# Altium schematic sheet Power Regulator.SchDoc
size A4; SheetNumber: 2; SheetTotal: 8
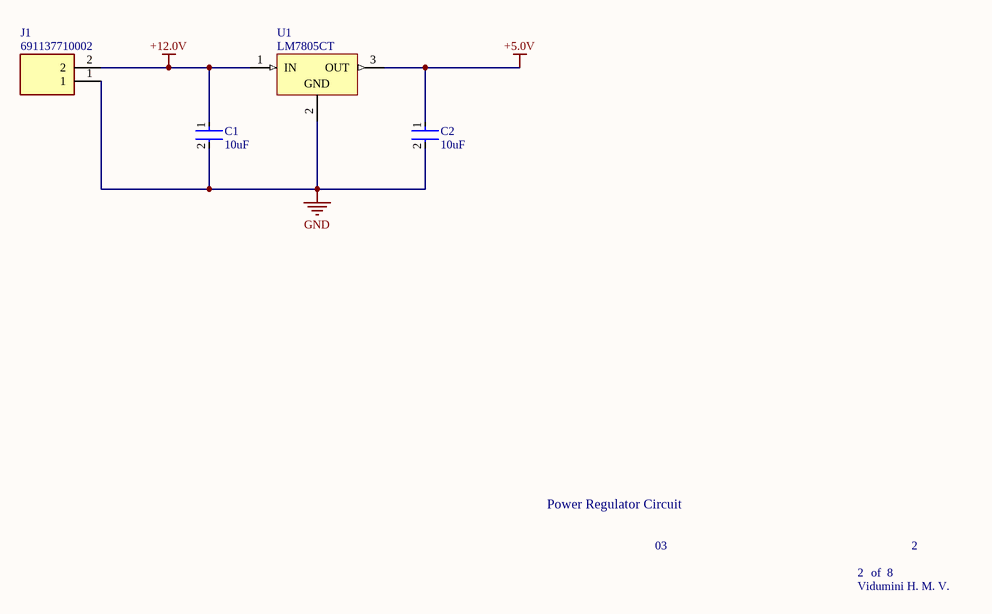
[diagram p0: Power Regulator.SchDoc]

## Parts
C1  10uF  [FP-1206-L_3_2_0_2-W_1_6_0-IPC_B]
C2  10uF  [FP-1206-L_3_2_0_2-W_1_6_0-IPC_B]
J1  691137710002  [SHDR2W70P0X500_1X2_1000X750X1160P]
U1  LM7805CT  [FAIR-TO-220-3]

## Nets
+5.0V: C2.1 U1.3(OUT)
+12.0V: C1.1 J1.2 U1.1(IN)
GND: C1.2 C2.2 J1.1 U1.2(GND)

## Notes on the sheet
- Power Regulator Circuit
- 03
- 2
- of  8
- Vidumini H. M. V.

## Library data of the parts
C1 C2 = CMP-2000-05863-2: General Purpose Ceramic Capacitor, 1206, 10uF, 10%, X5R, 15%, 25V; Height: 0.07mm; Packaging: Tape and Reel; Depth: 1.6mm; Voltage Rating (DC): 25V; Dielectric Material: Ceramic; Contact Plating: Tin; Width: 0.063inch; Capacitance: 10uF; Length: 3.2mm; Thickness: 0.07inch; Voltage Rating: 25V; RoHS Compliant: Yes; Min Operating Temperature: -55°C; Construction: Flat; Case Code (Imperial): 1206; Case Code (Metric): 3216; Mount: Surface Mount; Radiation Hardening: No; Termination: SMD/SMT; Package Quantity: 1; REACH SVHC: No SVHC; Number of Pins: 2; Tolerance: 10%; Series: -; Case/Package: 1206; Voltage: 25V; Dielectric: X5R; Max Operating Temperature: 85°C; Lead Free: Lead Free
J1 = 691137710002: Connector; Manufacturer_Name: Wurth Elektronik; Datasheet Link: https://katalog.we-online.com/em/datasheet/691137710002.pdf; Height: 11.6mm; Manufacturer_Part_Number: 691137710002; Mouser Part Number: 710-691137710002; Mouser Price/Stock: https://www.mouser.co.uk/ProductDetail/Wurth-Elektronik/691137710002?qs=lBTPRtX1sU9LnHBbviNKGA%3D%3D
U1 = CMP-2000-04938-1: Positive Voltage Regulator, 5 V, 1 A, -40 to 125 degC, 3-Pin TO-220, RoHS, Tube; Manufacturer: FairchildSemiconductor; Maximum Input Voltage: 35V; Maximum Quiescent Current: 8mA; Load Regulation: 100mV; Maximum Output Current: 2.2(Typ)A; Output Type: Fixed; Typical Dropout Voltage @ Current: 2@1AV; Rad Hard: No; Output Voltage: 5V; Accuracy: ±4%; Number of Outputs: 1; Category: LinearRegulator; Package Description: 3-Pin Through Hole Device, Body 10 x 4.5 mm, Pitch 2.54 mm; Packaging: Rail/Tube; Mounting: ThroughHole; Polarity: Positive; Manufacturer URL: https://www.fairchildsemi.com/; Line Regulation: 100mV; Datasheet Version: Aug-12; Datasheet URL: https://datasheet.ciiva.com/26904/lm7805ct-26904988.pdf; Package Reference: TO-220; Package URL: https://www.fairchildsemi.com/package-drawings/TO/TO220B03.pdf; Package: 3TO-220AB; Operating Temperature: -40to125degC; Type: Linear